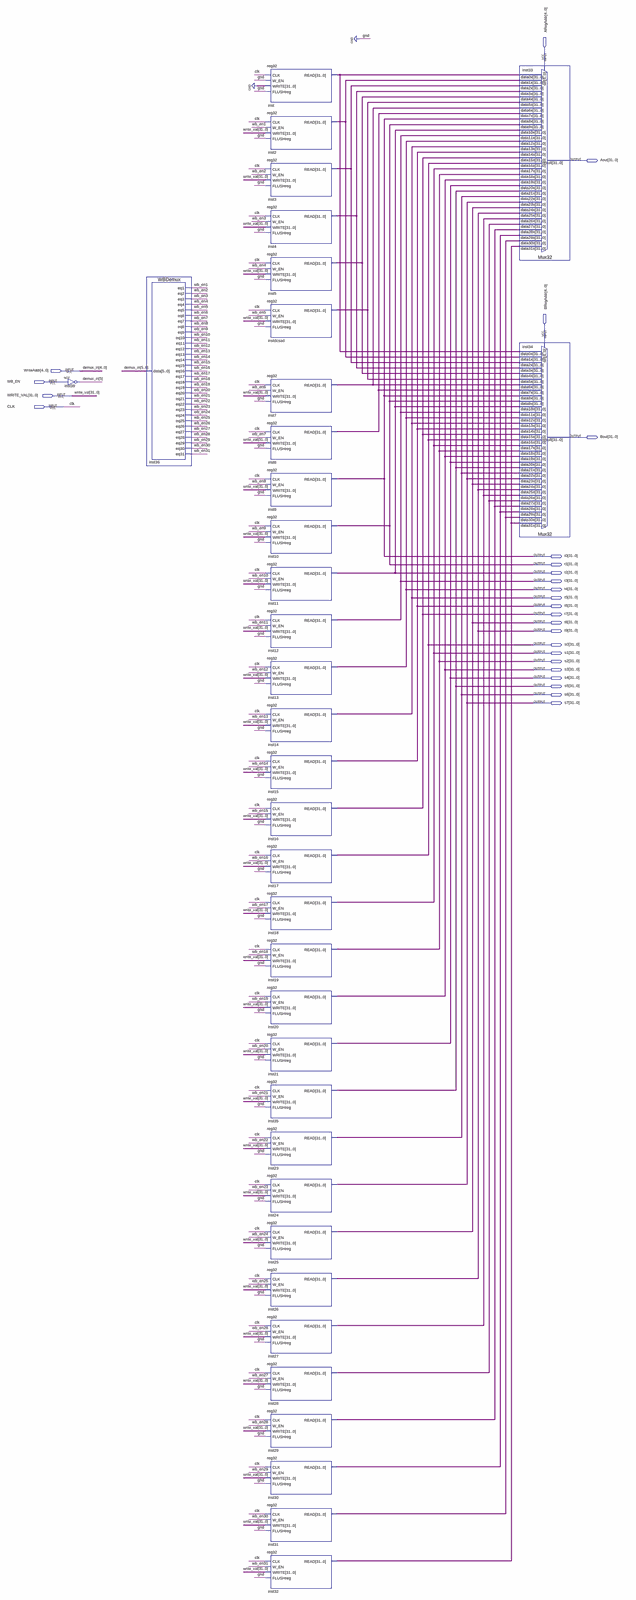
[diagram p0: schematic sheet, whole]
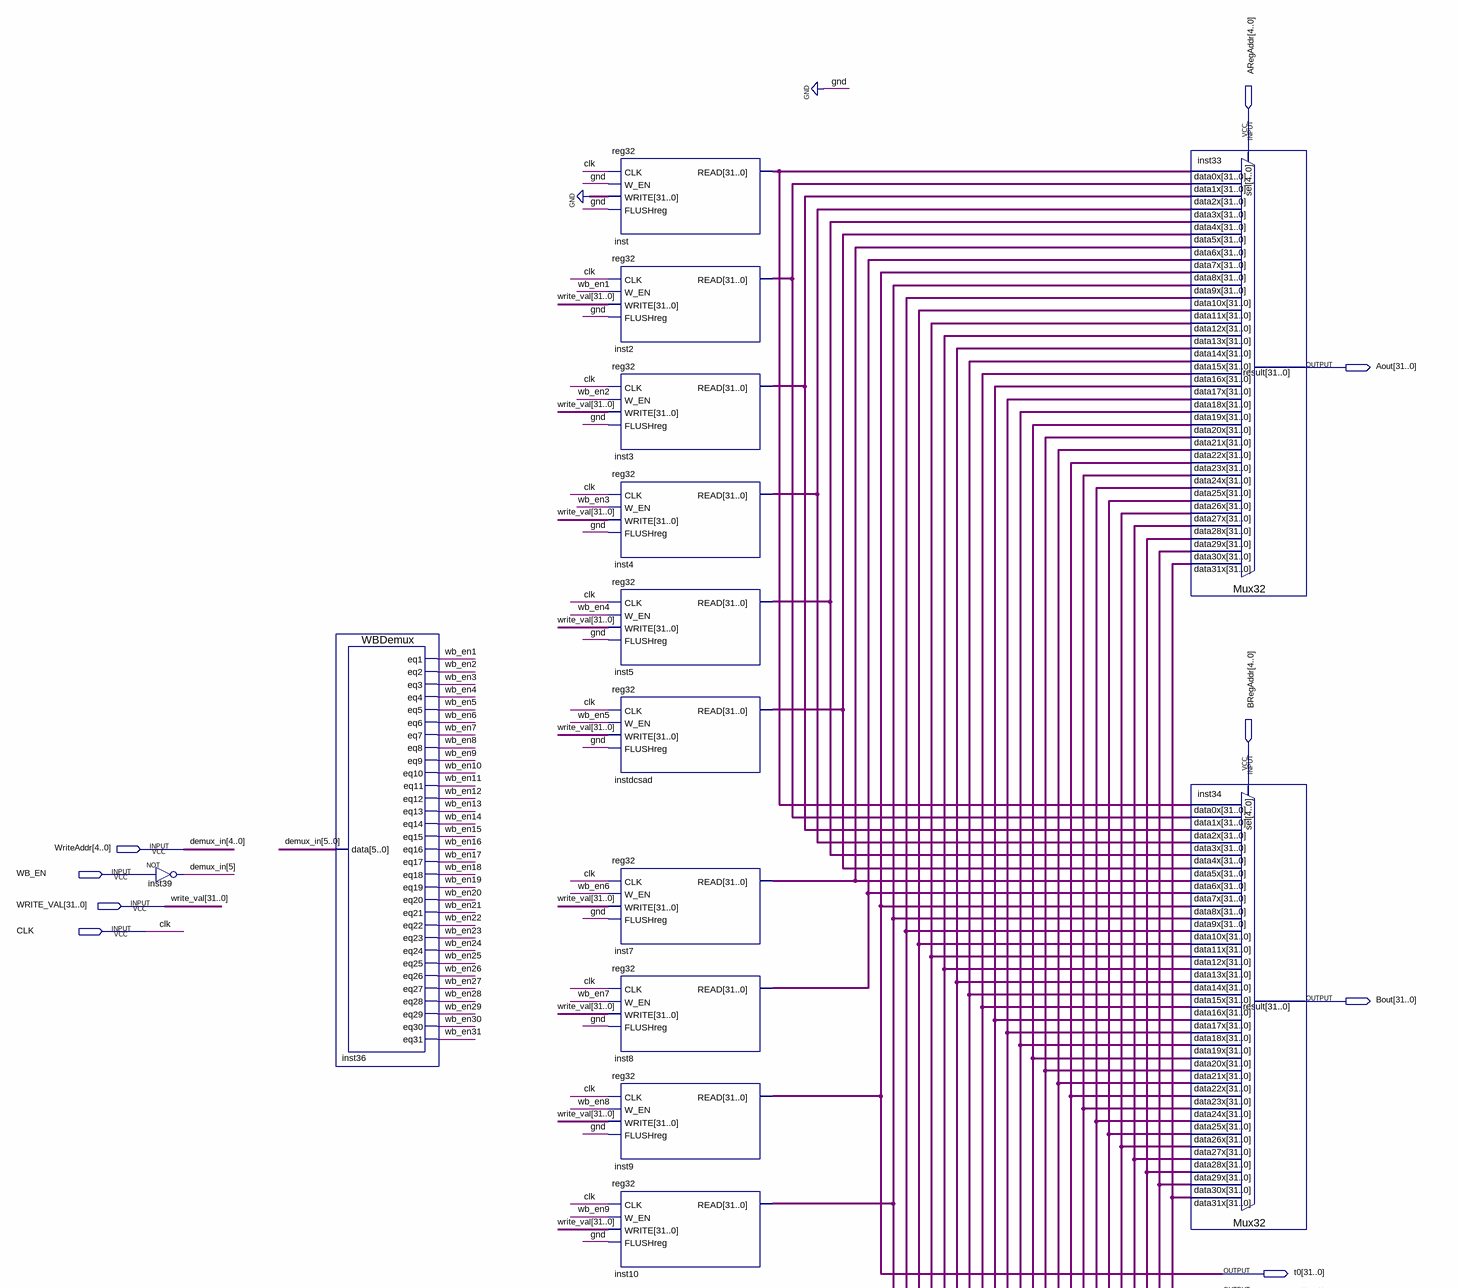
[diagram p1: schematic sheet, upper part]
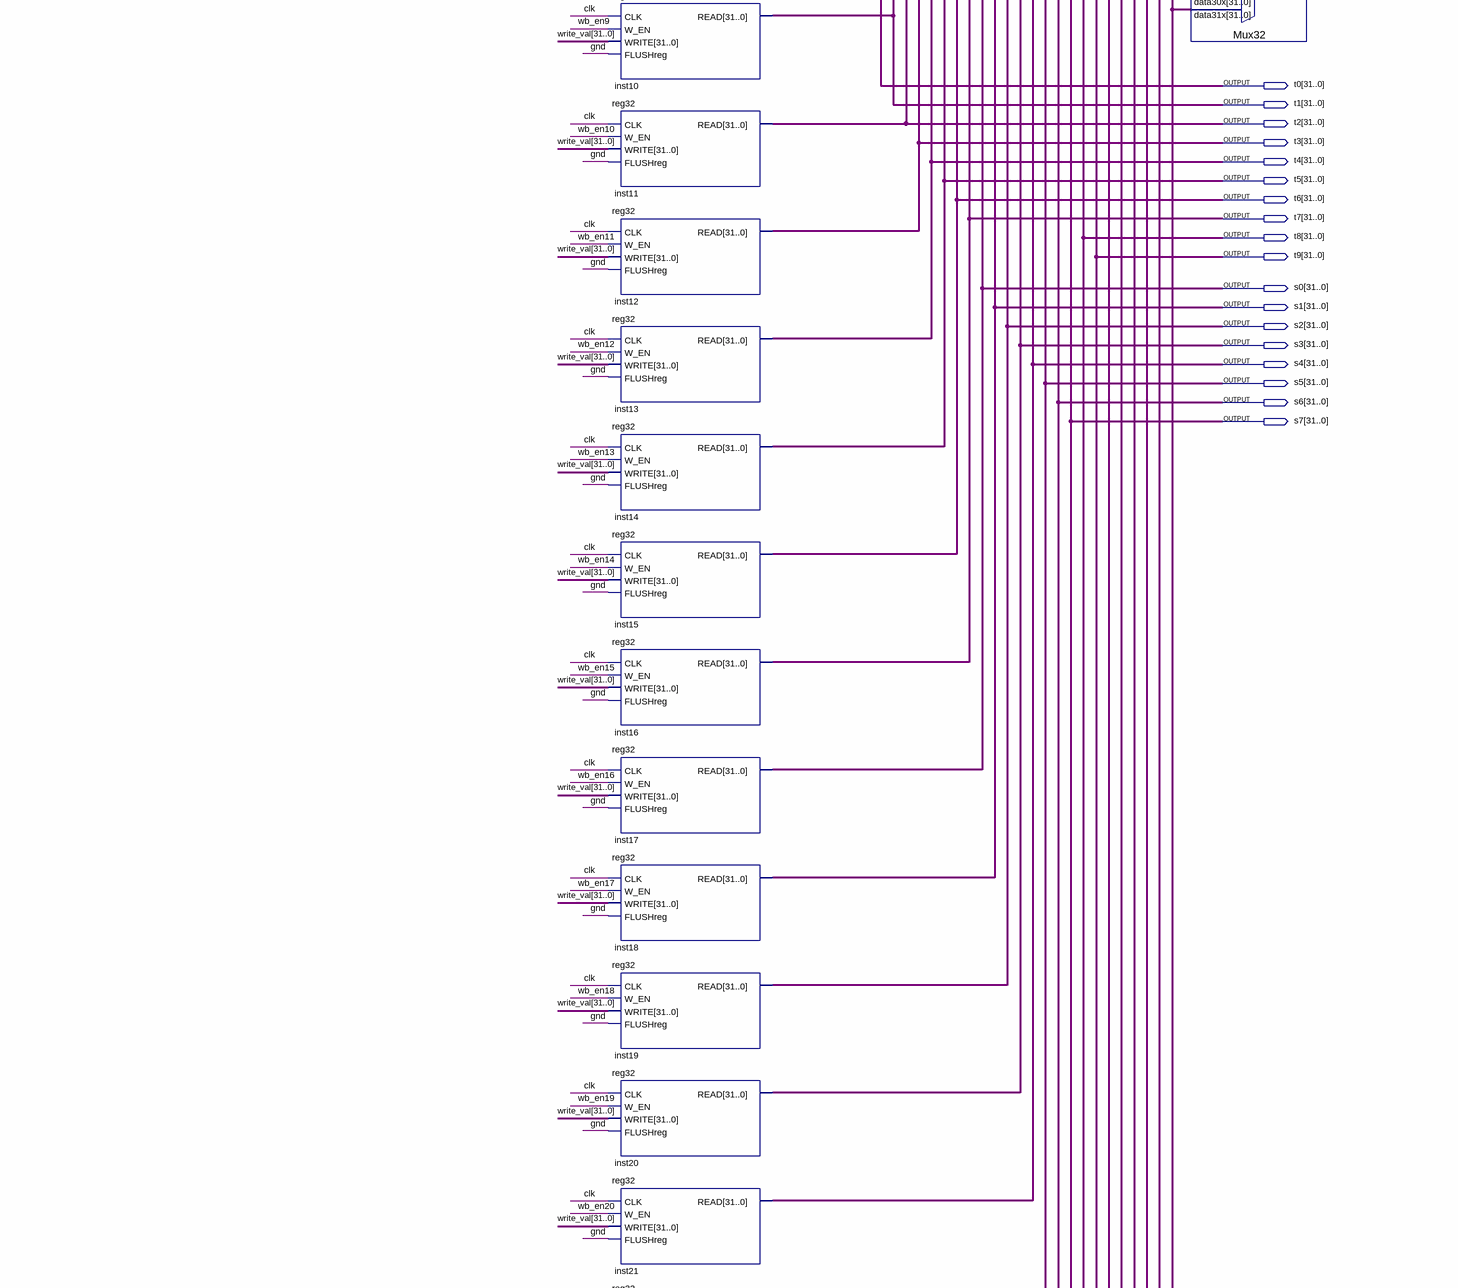
[diagram p2: schematic sheet, middle part]
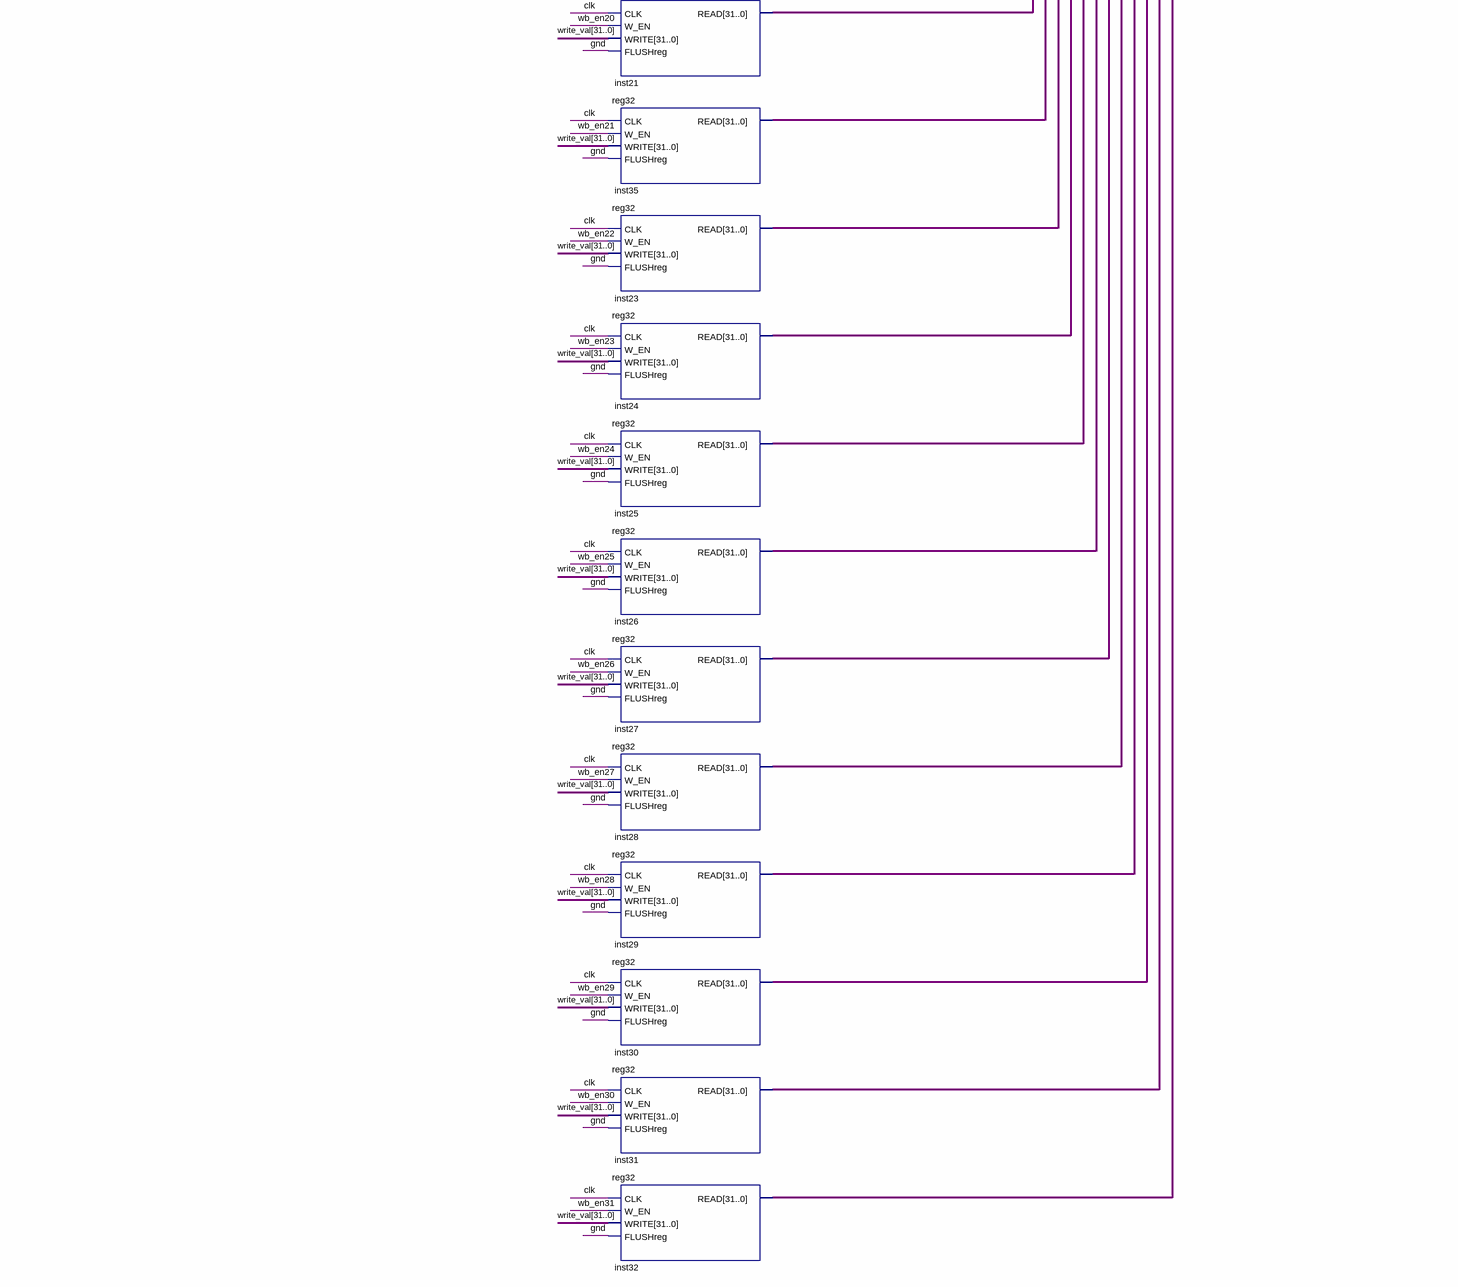
[diagram p3: schematic sheet, lower part]
// Quartus schematic RegBank.bdf as structural Verilog: 36 symbols, 26 pins
module RegBank (
  input  [4:0] ARegAddr,
  input  [4:0] BRegAddr,
  input  [4:0] WriteAddr,
  input  WB_EN,
  input  [31:0] WRITE_VAL,
  input  CLK,
  output [31:0] Aout,
  output [31:0] Bout,
  output [31:0] t0,
  output [31:0] t1,
  output [31:0] t2,
  output [31:0] t3,
  output [31:0] t4,
  output [31:0] t5,
  output [31:0] t6,
  output [31:0] t7,
  output [31:0] t8,
  output [31:0] t9,
  output [31:0] s0,
  output [31:0] s1,
  output [31:0] s2,
  output [31:0] s3,
  output [31:0] s4,
  output [31:0] s5,
  output [31:0] s6,
  output [31:0] s7
);

  wire wb_en1, wb_en2, wb_en3, wb_en4, wb_en5, wb_en6, wb_en7, wb_en8, wb_en9, wb_en10, wb_en11, wb_en12,
       wb_en13, wb_en14, wb_en15, wb_en16, wb_en17, wb_en18, wb_en19, wb_en20, wb_en21, wb_en22, wb_en23,
       wb_en24, wb_en25, wb_en26, wb_en27, wb_en28, wb_en29, wb_en30, wb_en31;
  wire [5:5] demux_in;
  wire [31:0] inst2_read, inst3_read, inst4_read, inst5_read, inst7_read, inst8_read, inst27_read,
       inst28_read, inst29_read, inst30_read, inst31_read, inst32_read, inst_read, instdcsad_read;

  not inst39 (demux_in[5], WB_EN);
  WBDemux inst36 (
    .data({demux_in[5], WriteAddr}), .eq1(wb_en1), .eq2(wb_en2), .eq3(wb_en3), .eq4(wb_en4), .eq5(wb_en5),
    .eq6(wb_en6), .eq7(wb_en7), .eq8(wb_en8), .eq9(wb_en9), .eq10(wb_en10), .eq11(wb_en11), .eq12(wb_en12),
    .eq13(wb_en13), .eq14(wb_en14), .eq15(wb_en15), .eq16(wb_en16), .eq17(wb_en17), .eq18(wb_en18),
    .eq19(wb_en19), .eq20(wb_en20), .eq21(wb_en21), .eq22(wb_en22), .eq23(wb_en23), .eq24(wb_en24),
    .eq25(wb_en25), .eq26(wb_en26), .eq27(wb_en27), .eq28(wb_en28), .eq29(wb_en29), .eq30(wb_en30),
    .eq31(wb_en31));
  reg32 inst (.CLK(CLK), .W_EN(1'b0), .WRITE({32{1'b0}}), .FLUSHreg(1'b0), .READ(inst_read));
  reg32 inst2 (.CLK(CLK), .W_EN(wb_en1), .WRITE(WRITE_VAL), .FLUSHreg(1'b0), .READ(inst2_read));
  reg32 inst3 (.CLK(CLK), .W_EN(wb_en2), .WRITE(WRITE_VAL), .FLUSHreg(1'b0), .READ(inst3_read));
  reg32 inst4 (.CLK(CLK), .W_EN(wb_en3), .WRITE(WRITE_VAL), .FLUSHreg(1'b0), .READ(inst4_read));
  reg32 inst5 (.CLK(CLK), .W_EN(wb_en4), .WRITE(WRITE_VAL), .FLUSHreg(1'b0), .READ(inst5_read));
  reg32 instdcsad (.CLK(CLK), .W_EN(wb_en5), .WRITE(WRITE_VAL), .FLUSHreg(1'b0), .READ(instdcsad_read));
  reg32 inst7 (.CLK(CLK), .W_EN(wb_en6), .WRITE(WRITE_VAL), .FLUSHreg(1'b0), .READ(inst7_read));
  reg32 inst8 (.CLK(CLK), .W_EN(wb_en7), .WRITE(WRITE_VAL), .FLUSHreg(1'b0), .READ(inst8_read));
  reg32 inst9 (.CLK(CLK), .W_EN(wb_en8), .WRITE(WRITE_VAL), .FLUSHreg(1'b0), .READ(t0));
  reg32 inst10 (.CLK(CLK), .W_EN(wb_en9), .WRITE(WRITE_VAL), .FLUSHreg(1'b0), .READ(t1));
  reg32 inst11 (.CLK(CLK), .W_EN(wb_en10), .WRITE(WRITE_VAL), .FLUSHreg(1'b0), .READ(t2));
  reg32 inst12 (.CLK(CLK), .W_EN(wb_en11), .WRITE(WRITE_VAL), .FLUSHreg(1'b0), .READ(t3));
  reg32 inst13 (.CLK(CLK), .W_EN(wb_en12), .WRITE(WRITE_VAL), .FLUSHreg(1'b0), .READ(t4));
  reg32 inst14 (.CLK(CLK), .W_EN(wb_en13), .WRITE(WRITE_VAL), .FLUSHreg(1'b0), .READ(t5));
  reg32 inst15 (.CLK(CLK), .W_EN(wb_en14), .WRITE(WRITE_VAL), .FLUSHreg(1'b0), .READ(t6));
  reg32 inst16 (.CLK(CLK), .W_EN(wb_en15), .WRITE(WRITE_VAL), .FLUSHreg(1'b0), .READ(t7));
  reg32 inst17 (.CLK(CLK), .W_EN(wb_en16), .WRITE(WRITE_VAL), .FLUSHreg(1'b0), .READ(s0));
  reg32 inst18 (.CLK(CLK), .W_EN(wb_en17), .WRITE(WRITE_VAL), .FLUSHreg(1'b0), .READ(s1));
  reg32 inst19 (.CLK(CLK), .W_EN(wb_en18), .WRITE(WRITE_VAL), .FLUSHreg(1'b0), .READ(s2));
  reg32 inst20 (.CLK(CLK), .W_EN(wb_en19), .WRITE(WRITE_VAL), .FLUSHreg(1'b0), .READ(s3));
  reg32 inst21 (.CLK(CLK), .W_EN(wb_en20), .WRITE(WRITE_VAL), .FLUSHreg(1'b0), .READ(s4));
  reg32 inst35 (.CLK(CLK), .W_EN(wb_en21), .WRITE(WRITE_VAL), .FLUSHreg(1'b0), .READ(s5));
  reg32 inst23 (.CLK(CLK), .W_EN(wb_en22), .WRITE(WRITE_VAL), .FLUSHreg(1'b0), .READ(s6));
  reg32 inst24 (.CLK(CLK), .W_EN(wb_en23), .WRITE(WRITE_VAL), .FLUSHreg(1'b0), .READ(s7));
  reg32 inst25 (.CLK(CLK), .W_EN(wb_en24), .WRITE(WRITE_VAL), .FLUSHreg(1'b0), .READ(t8));
  reg32 inst26 (.CLK(CLK), .W_EN(wb_en25), .WRITE(WRITE_VAL), .FLUSHreg(1'b0), .READ(t9));
  reg32 inst27 (.CLK(CLK), .W_EN(wb_en26), .WRITE(WRITE_VAL), .FLUSHreg(1'b0), .READ(inst27_read));
  reg32 inst28 (.CLK(CLK), .W_EN(wb_en27), .WRITE(WRITE_VAL), .FLUSHreg(1'b0), .READ(inst28_read));
  reg32 inst29 (.CLK(CLK), .W_EN(wb_en28), .WRITE(WRITE_VAL), .FLUSHreg(1'b0), .READ(inst29_read));
  reg32 inst30 (.CLK(CLK), .W_EN(wb_en29), .WRITE(WRITE_VAL), .FLUSHreg(1'b0), .READ(inst30_read));
  reg32 inst31 (.CLK(CLK), .W_EN(wb_en30), .WRITE(WRITE_VAL), .FLUSHreg(1'b0), .READ(inst31_read));
  reg32 inst32 (.CLK(CLK), .W_EN(wb_en31), .WRITE(WRITE_VAL), .FLUSHreg(1'b0), .READ(inst32_read));
  Mux32 inst33 (
    .data31x(inst32_read), .data30x(inst31_read), .data29x(inst30_read), .data28x(inst29_read),
    .data27x(inst28_read), .data26x(inst27_read), .data25x(t9), .data24x(t8), .data23x(s7), .data22x(s6),
    .data21x(s5), .data20x(s4), .data19x(s3), .data18x(s2), .data17x(s1), .data16x(s0), .data15x(t7),
    .data14x(t6), .data13x(t5), .data12x(t4), .data11x(t3), .data10x(t2), .data9x(t1), .data8x(t0),
    .data7x(inst8_read), .data6x(inst7_read), .data5x(instdcsad_read), .data4x(inst5_read),
    .data3x(inst4_read), .data2x(inst3_read), .data1x(inst2_read), .data0x(inst_read), .sel(ARegAddr),
    .result(Aout));
  Mux32 inst34 (
    .data31x(inst32_read), .data30x(inst31_read), .data29x(inst30_read), .data28x(inst29_read),
    .data27x(inst28_read), .data26x(inst27_read), .data25x(t9), .data24x(t8), .data23x(s7), .data22x(s6),
    .data21x(s5), .data20x(s4), .data19x(s3), .data18x(s2), .data17x(s1), .data16x(s0), .data15x(t7),
    .data14x(t6), .data13x(t5), .data12x(t4), .data11x(t3), .data10x(t2), .data9x(t1), .data8x(t0),
    .data7x(inst8_read), .data6x(inst7_read), .data5x(instdcsad_read), .data4x(inst5_read),
    .data3x(inst4_read), .data2x(inst3_read), .data1x(inst2_read), .data0x(inst_read), .sel(BRegAddr),
    .result(Bout));

  // Other names for the same wires on the sheet: demux_in[4:0] = WriteAddr
endmodule
